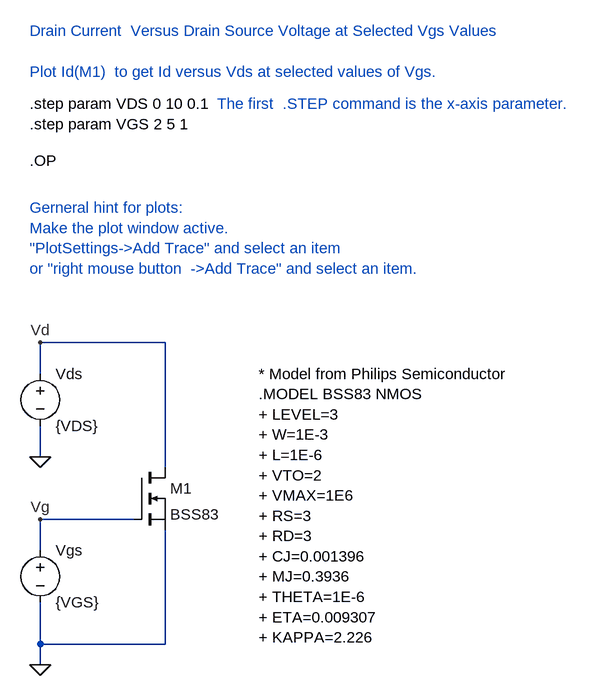
[diagram p0: schematic id_of_vds_stepped_vgs.asc]
id_of_vds_stepped_vgs.asc, the LTspice schematic file:
Version 4
SHEET 1 1208 724
WIRE -96 304 -96 256
WIRE 96 416 96 592
WIRE 96 592 -96 592
WIRE -96 448 -96 400
WIRE -96 528 -96 592
WIRE -96 624 -96 592
WIRE -96 176 -96 128
WIRE 48 400 -96 400
WIRE -96 128 96 128
WIRE 96 128 96 320
FLAG -96 624 0
FLAG -96 304 0
FLAG -96 128 Vd
FLAG -96 400 Vg
SYMBOL voltage -96 432 R0
WINDOW 123 24 132 Left 0
WINDOW 39 0 0 Left 0
SYMATTR InstName Vgs
SYMATTR Value {VGS}
SYMBOL voltage -96 160 R0
WINDOW 123 24 132 Left 0
WINDOW 39 0 0 Left 0
SYMATTR InstName Vds
SYMATTR Value {VDS}
SYMBOL nmos 48 320 R0
SYMATTR InstName M1
SYMATTR Value BSS83
TEXT -112 -240 Left 0 !.step param VDS 0 10 0.1\n.step param VGS 2 5 1
TEXT -112 -152 Left 0 !.OP
TEXT -112 -352 Left 0 ;Drain Current  Versus Drain Source Voltage at Selected Vgs Values\n \nPlot Id(M1)  to get Id versus Vds at selected values of Vgs.
TEXT -112 -80 Left 0 ;Gerneral hint for plots:\nMake the plot window active. \n"PlotSettings->Add Trace" and select an item\nor "right mouse button  ->Add Trace" and select an item.
TEXT 240 176 Left 0 !* Model from Philips Semiconductor\n.MODEL BSS83 NMOS\n+ LEVEL=3\n+ W=1E-3\n+ L=1E-6\n+ VTO=2\n+ VMAX=1E6\n+ RS=3\n+ RD=3\n+ CJ=0.001396\n+ MJ=0.3936\n+ THETA=1E-6\n+ ETA=0.009307\n+ KAPPA=2.226
TEXT 176 -240 Left 0 ;The first  .STEP command is the x-axis parameter.

The netlist it stands for:
* id_of_vds_stepped_vgs.asc
Vgs Vg 0 {VGS}
Vds Vd 0 {VDS}
M1 Vd Vg 0 0 BSS83
.model NMOS NMOS
.model PMOS PMOS
.lib standard.mos
.step param VDS 0 10 0.1
.step param VGS 2 5 1
.OP
* Drain Current  Versus Drain Source Voltage at Selected Vgs Values
* Plot Id(M1)  to get Id versus Vds at selected values of Vgs.
* Gerneral hint for plots:
* Make the plot window active.
* "PlotSettings->Add Trace" and select an item
* or "right mouse button  ->Add Trace" and select an item.
* Model from Philips Semiconductor
.MODEL BSS83 NMOS
+ LEVEL=3
+ W=1E-3
+ L=1E-6
+ VTO=2
+ VMAX=1E6
+ RS=3
+ RD=3
+ CJ=0.001396
+ MJ=0.3936
+ THETA=1E-6
+ ETA=0.009307
+ KAPPA=2.226
* The first  .STEP command is the x-axis parameter.
.backanno
.end